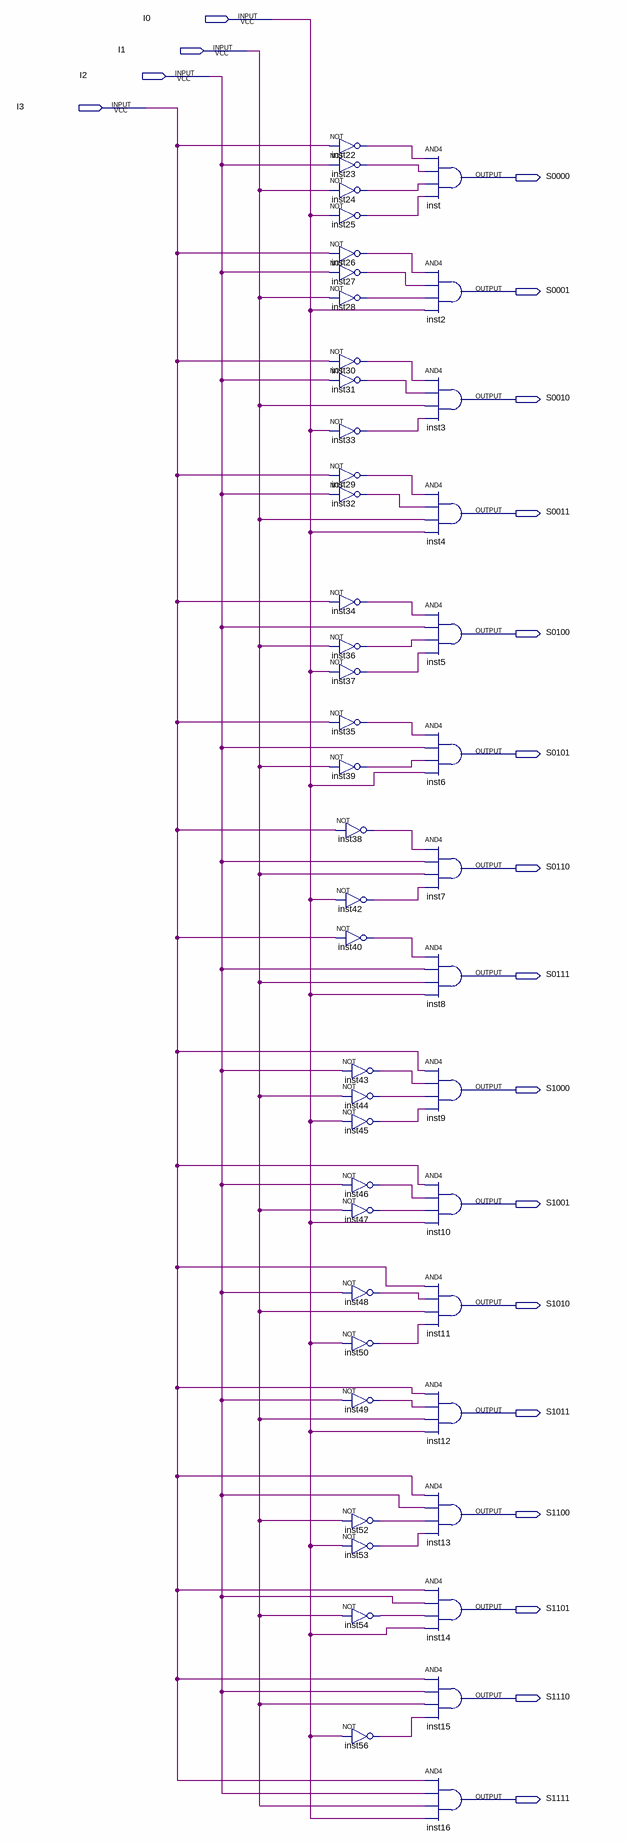
[diagram p0: schematic sheet]
// Quartus schematic decod4x16.bdf as structural Verilog: 48 symbols, 20 pins
module decod4x16 (
  input  I0,
  input  I1,
  input  I2,
  input  I3,
  output S0000,
  output S0001,
  output S0010,
  output S0011,
  output S0100,
  output S0101,
  output S0110,
  output S0111,
  output S1000,
  output S1001,
  output S1010,
  output S1011,
  output S1100,
  output S1101,
  output S1110,
  output S1111
);

  wire inst22_out, inst23_out, inst24_out, inst25_out, inst26_out, inst27_out, inst28_out, inst29_out,
       inst30_out, inst31_out, inst32_out, inst33_out, inst34_out, inst35_out, inst36_out, inst37_out,
       inst38_out, inst39_out, inst40_out, inst42_out, inst43_out, inst44_out, inst45_out, inst46_out,
       inst47_out, inst48_out, inst49_out, inst50_out, inst52_out, inst53_out, inst54_out, inst56_out;

  not inst22 (inst22_out, I3);
  not inst23 (inst23_out, I2);
  not inst24 (inst24_out, I1);
  not inst25 (inst25_out, I0);
  not inst26 (inst26_out, I3);
  not inst27 (inst27_out, I2);
  not inst28 (inst28_out, I1);
  not inst30 (inst30_out, I3);
  not inst31 (inst31_out, I2);
  not inst33 (inst33_out, I0);
  not inst29 (inst29_out, I3);
  not inst32 (inst32_out, I2);
  not inst34 (inst34_out, I3);
  not inst36 (inst36_out, I1);
  not inst37 (inst37_out, I0);
  not inst35 (inst35_out, I3);
  not inst39 (inst39_out, I1);
  not inst38 (inst38_out, I3);
  not inst42 (inst42_out, I0);
  not inst40 (inst40_out, I3);
  not inst43 (inst43_out, I2);
  not inst44 (inst44_out, I1);
  not inst45 (inst45_out, I0);
  not inst46 (inst46_out, I2);
  not inst47 (inst47_out, I1);
  not inst48 (inst48_out, I2);
  not inst50 (inst50_out, I0);
  not inst49 (inst49_out, I2);
  not inst52 (inst52_out, I1);
  not inst53 (inst53_out, I0);
  not inst54 (inst54_out, I1);
  not inst56 (inst56_out, I0);
  and inst (S0000, inst22_out, inst23_out, inst24_out, inst25_out);
  and inst2 (S0001, inst26_out, inst27_out, inst28_out, I0);
  and inst3 (S0010, inst30_out, inst31_out, I1, inst33_out);
  and inst4 (S0011, inst29_out, inst32_out, I1, I0);
  and inst5 (S0100, inst34_out, I2, inst36_out, inst37_out);
  and inst6 (S0101, inst35_out, I2, inst39_out, I0);
  and inst7 (S0110, inst38_out, I2, I1, inst42_out);
  and inst8 (S0111, inst40_out, I2, I1, I0);
  and inst9 (S1000, I3, inst43_out, inst44_out, inst45_out);
  and inst10 (S1001, I3, inst46_out, inst47_out, I0);
  and inst11 (S1010, I3, inst48_out, I1, inst50_out);
  and inst12 (S1011, I3, inst49_out, I1, I0);
  and inst13 (S1100, I3, I2, inst52_out, inst53_out);
  and inst14 (S1101, I3, I2, inst54_out, I0);
  and inst15 (S1110, I3, I2, I1, inst56_out);
  and inst16 (S1111, I3, I2, I1, I0);
endmodule
